# EAGLE design pumpkin_shield (EAGLE 5.11)
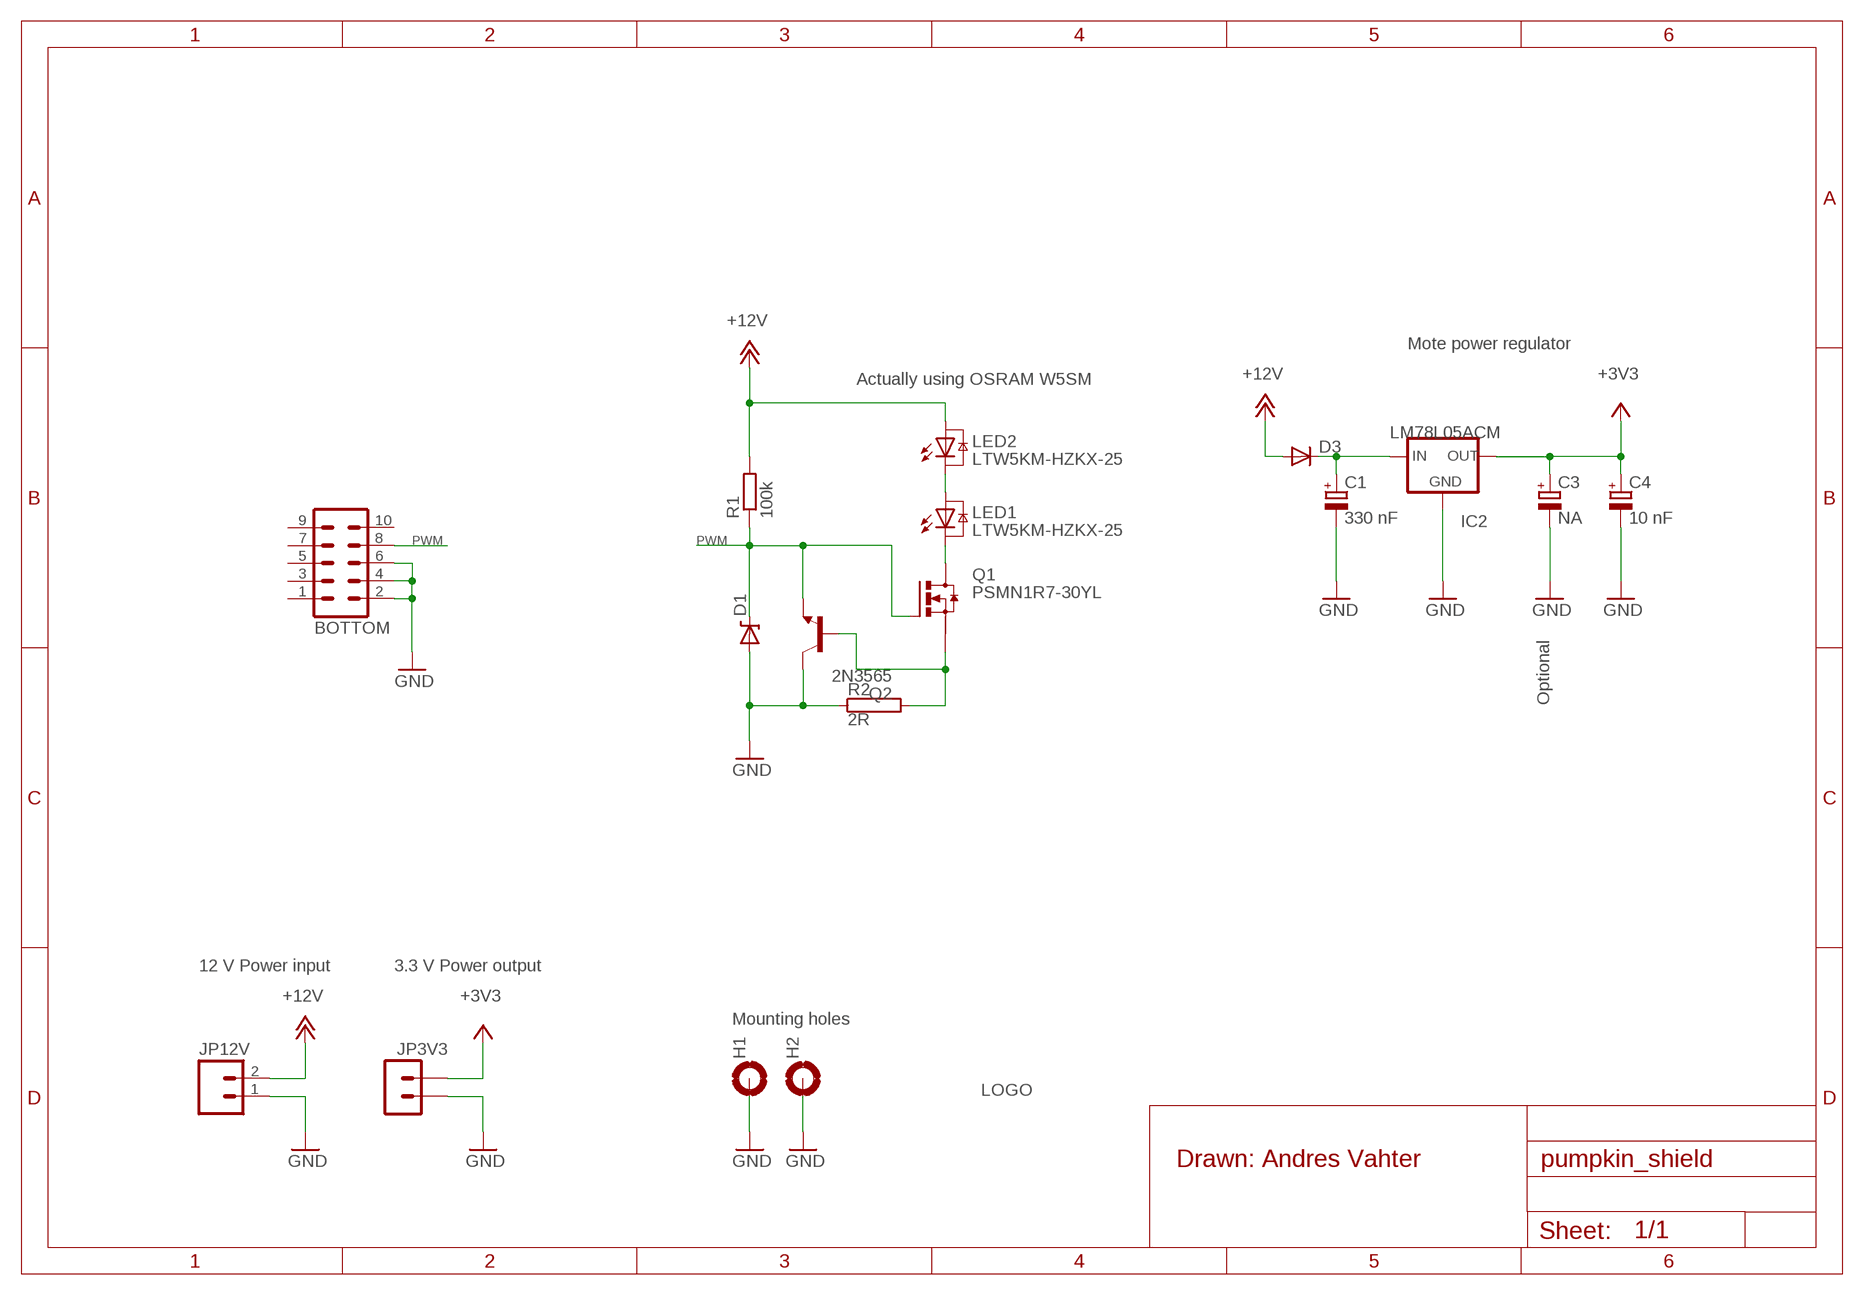
[diagram p0: schematic, sheet 1]

## Parts
BOTTOM  FTSH-105-04-L-DV  [FTSH-105-04-L-DV]
C1  330 nF  CPOL-EUCT6032  [CT6032]
C3  NA  CPOL-EUCT6032  [CT6032]
C4  10 nF  CPOL-EUCT6032  [CT6032]
D1  DIODE-ZENER-BZT52  [SOD-323]
D3  DIODE-DO-214AC  [DO-214AC]
H1  MOUNT-PAD-ROUND3.2  [3,2-PAD]
H2  MOUNT-PAD-ROUND3.2  [3,2-PAD]
IC2  LM78L05ACM  LM78LXX  [SO8]
JP3V3  MICROSPOX  [MICROSPOX]
JP12V  M02PTH  [1X02]
LED1  LTW5KM-HZKX-25  [W5KM]
LED2  LTW5KM-HZKX-25  [W5KM]
Q1  PSMN1R7-30YL  PH7030L  [SOT669]
Q2  2N3565  [TO92]
R1  100k  R-EU_M1206  [M1206]
R2  2R  RAC01  [AC01]
U$1  LOGOSILK  [LOGO_TOP_COPPER]

## Nets
+3V3: C3.+ C4.+ IC2.1(OUT) JP3V3.P$1
+12V: D3.A JP12V.2 LED2.A R1.2
GND: BOTTOM.2 BOTTOM.4 BOTTOM.6 C1.- C3.- C4.- D1.2(A) H1.B3,2(MOUNT) H2.B3,2(MOUNT) IC2.2(GND) JP3V3.P$2 JP12V.1 Q2.1(C) R2.1
N$2: Q1.1(S) Q2.2(B) R2.2
N$7: C1.+ D3.C IC2.8(IN)
N$9: LED1.A LED2.C
N$10: LED1.C Q1.MB(D)
PWM: BOTTOM.8 D1.1(C) Q1.4(G) Q2.3(E) R1.1
Unconnected: BOTTOM.1 BOTTOM.3 BOTTOM.5 BOTTOM.7 BOTTOM.9 BOTTOM.10 LED1.HT@1(TH) LED1.HT@2(TH) LED1.TH LED2.HT@1(TH) LED2.HT@2(TH) LED2.TH Q1.2(S) Q1.3(S)

## Notes on the sheet
- Mote power regulator
- Actually using OSRAM W5SM
- Optional
- 12 V Power input | 3.3 V Power output
- Mounting holes
- Drawn: Andres Vahter

## Power pins joined to a net without a drawn wire
GND: IC2.3(GND) IC2.6(GND) IC2.7(GND)

## Library data of the parts
BOTTOM = Samtec:FTSH-105-04-L-DV: SAMTEC - FTSH-105-04-L-DV - HEADER, 1.27MM, 2X5WAY, SMT
C1 C3 C4 = rcl:CPOL-EU: POLARIZED CAPACITOR, European symbol
D1 = SparkFun:DIODE-ZENER: Zener Diode Production Part - 8199 3.4V Zener Voltage
D3 = Smartdust:DIODE-DO-214AC
H1 H2 = holes:MOUNT-PAD-ROUND: MOUNTING PAD, round
IC2 = Smartdust:LM78LXX
JP3V3 = Smartdust:MICROSPOX: Molex 22035025, 2 ways
JP12V = SparkFun:M02: Header 2 Standard 2-pin 0.1" header. Use with straight break away headers (SKU : PRT-00116), right angle break away headers (PRT-00553), swiss pins (PRT-00743), machine pins (PRT-00117), and female headers (PRT-00115). Molex polarized connector foot print use with SKU : PRT-08233 with associated crimp pins and housings.
LED1 LED2 = led:?W5KM: Golden DRAGON® ARGUS® LED Place TH-Gate and connect pins in schematic. Set DRC-Clearance - Same Signals to 0mm in board. Source: catalog.osram-os.com .. LD_LB_LT_W5KM_Pb_free.pdf; COLOR: true green
Q1 = transistor-power:PH7030L: N-channel TrenchMOS (TM) logic level FET Source: http://www.nxp.com/acrobat_download/datasheets/PH7030L_4.pdf
Q2 = transistor-npn:2N3565: NPN Transistor
R1 = rcl:R-EU_: RESISTOR, European symbol
R2 = resistor-power:R: Power Resitor; OC_FARNELL: unknown; OC_NEWARK: unknown
U$1 = Defendec_logo:LOGO

## Board
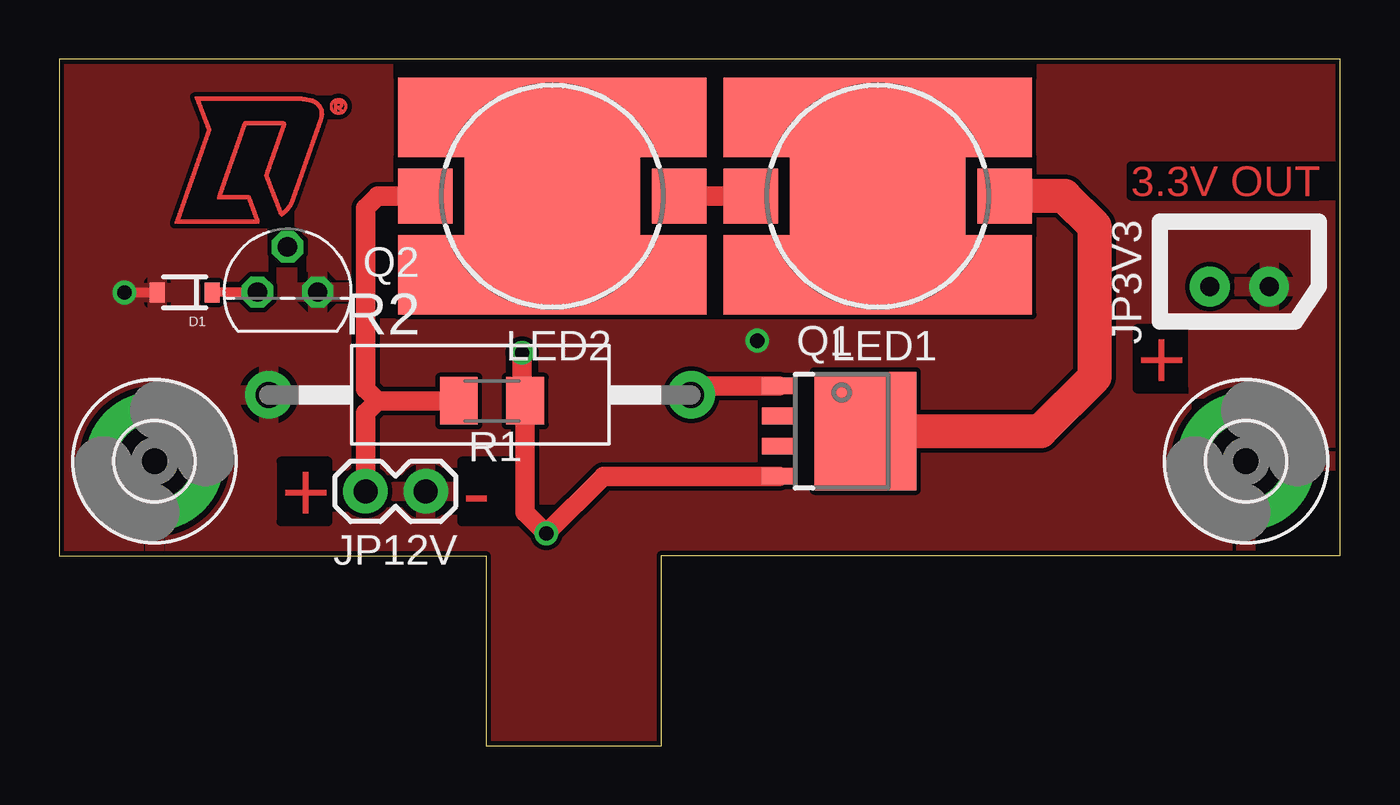
[diagram p1: board, top side]
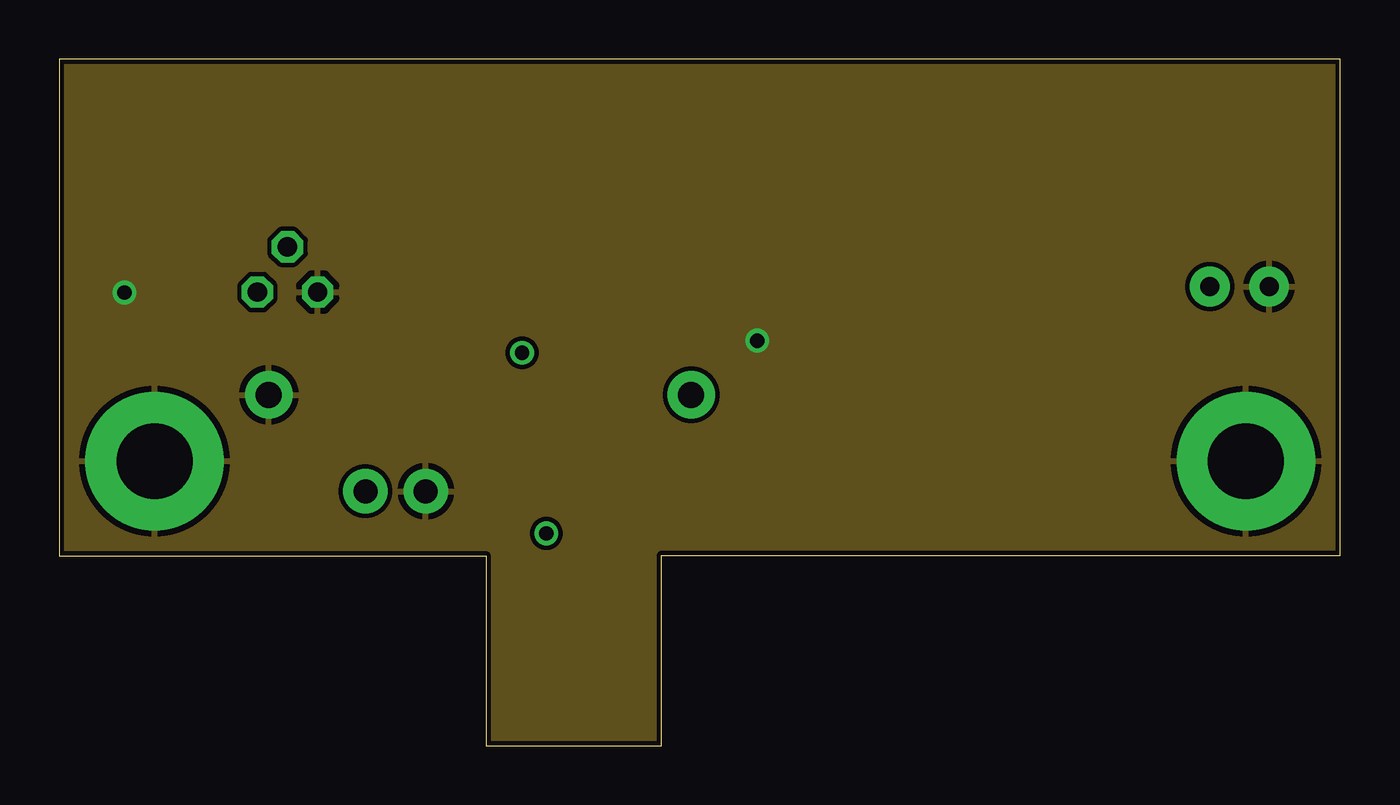
[diagram p2: board, inner layer Route2]
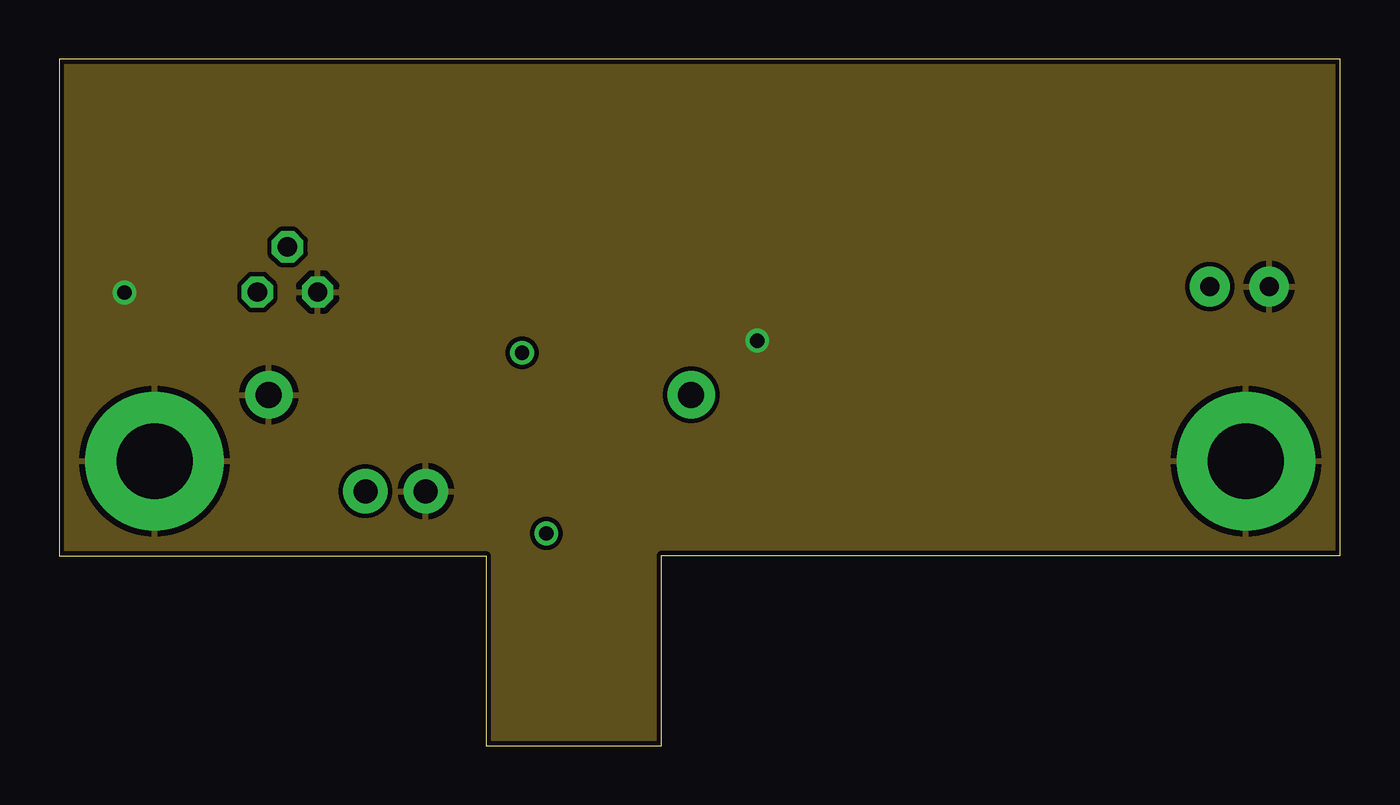
[diagram p3: board, inner layer Route15]
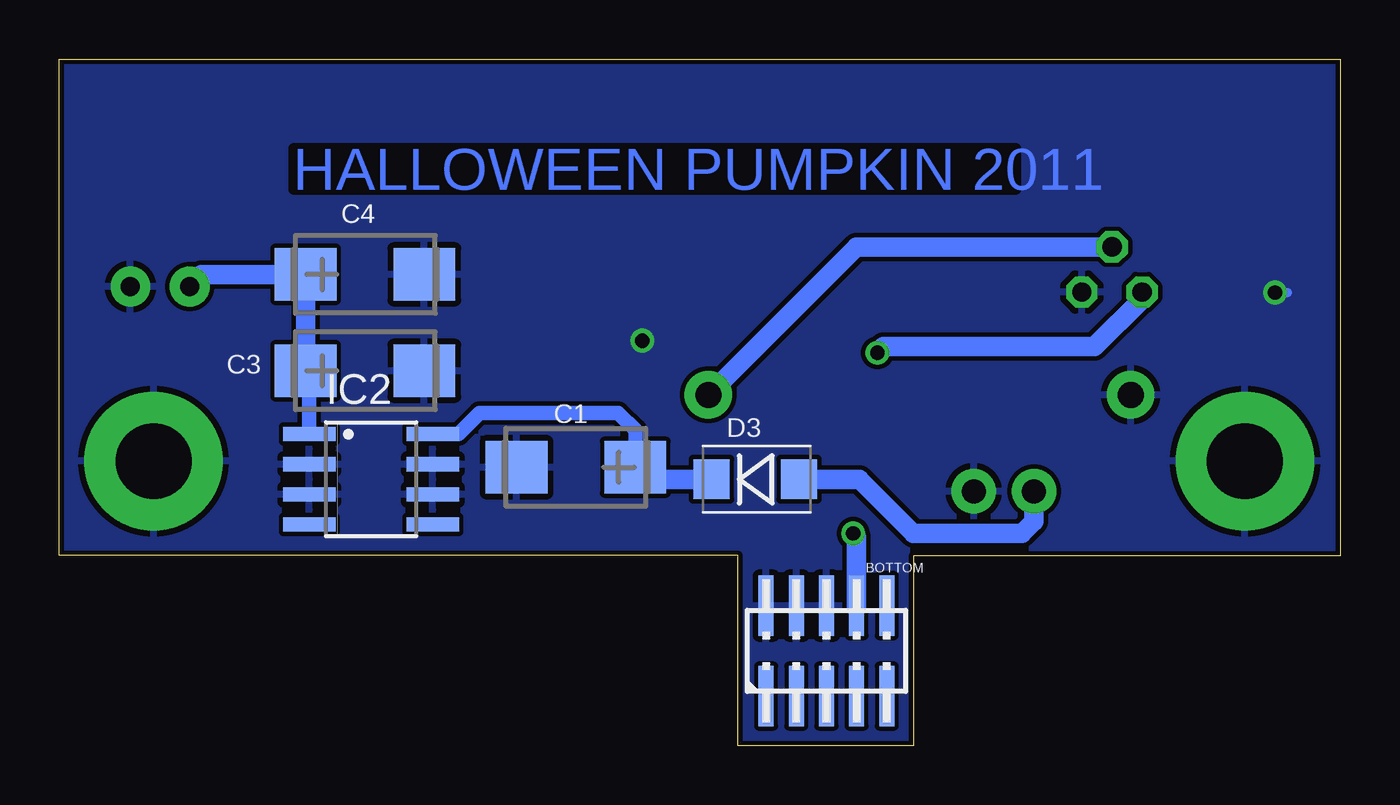
[diagram p4: board, bottom side, seen from below]

Size 53.98 x 28.93 mm. Coordinates in mm from the lower left corner, seen from the top.
Outline: 0,8 17.98,8 17.98,0 25.37,0 25.37,8.03 53.98,8.03 53.98,28.93 0,28.93 0,8
Copper layers (1*2+15*16): Top 0.035mm / dielectric 0.3mm / Route2 0.035mm / dielectric 0.3mm / Route15 0.035mm / dielectric 0.3mm / Bottom 0.035mm
Design rules "brandner": minimum track width 0.05mm, minimum drill 0.1mm, track to track 0.19mm, track to pad 0.19mm, pad to pad 0.19mm, via to via 0.19mm, smd to smd 0.19mm, copper to edge 0.2mm, drill to drill 0.15mm, minimum pad ring 10mil, minimum via ring 8mil, stop-mask expansion 0.05mm, vias tented up to drill 0.8mm, thermal gap 10mil

### Footprints (pad centres in the part's own frame; a part is rotated, then mirrored left to right if it is on the bottom)
FTSH-105-04-L-DV = smd 0.635 x 2.54: 1 -2.667,-1.905; 2 -2.667,1.905; 3 -1.397,-1.905; 4 -1.397,1.905; 5 -0.127,-1.905; 6 -0.127,1.905; 7 1.143,-1.905; 8 1.143,1.905; 9 2.413,-1.905; 10 2.413,1.905
CT6032 = smd 2.6 x 2.2: + -2.5,0; - 2.5,0
SOD-323 = smd 0.63 x 0.83: 1 -1.15,0; 2 1.15,0
DO-214AC = smd 1.524 x 1.676: A 1.778,0; C -1.905,0
3,2-PAD = drill 3.2 pad 5.842 round: B3,2 0,0
SO8 = smd 0.6 x 2.2: 1 -1.905,-2.6; 2 -0.635,-2.6; 3 0.635,-2.6; 4 1.905,-2.6; 5 1.905,2.6; 6 0.635,2.6; 7 -0.635,2.6; 8 -1.905,2.6
MICROSPOX = drill 0.8 pad 1.676 round: P$1 0,1.25; P$2 0,-1.25
1X02 = drill 1.016 pad 1.88 round: 1 0,0; 2 2.54,0
W5KM = smd 2.3 x 2.3: A 0,5.35; C 0,-5.35 | smd 3.35 x 13: HT@1 -3.325,0; HT@2 3.325,0 | smd 3.35 x 7.4: TH 0,0
SOT669 = smd 0.7 x 1.4: 1 -1.905,-2.65; 2 -0.635,-2.65; 3 0.635,-2.65; 4 1.905,-2.65 | smd 5 x 4.3: MB 0,1
TO92 = drill 0.813 octagon: 1 1.27,0; 2 0,1.905; 3 -1.27,0
M1206 = smd 1.6 x 2: 1 -1.4,0; 2 1.4,0
AC01 = drill 1.1 pad 2 round: 1 -8.9,0; 2 8.9,0

### Placement (x,y rotation side)
BOTTOM  21.52,3.99 0 bottom
C1  32.21,11.73 180 bottom
C3  41.1,15.8 0 bottom
C4  41.1,19.86 0 bottom
D1  5.28,19.1 180 top
D3  24.59,11.23 0 bottom
H1  4.01,11.99 0 top
H2  50.01,11.99 0 top
IC2  40.84,11.23 270 bottom
JP3V3  49.73,19.35 90 top
JP12V  15.44,10.72 180 top
LED1  34.49,23.16 90 top
LED2  20.78,23.16 90 top
Q1  32.97,13.26 270 top
Q2  9.62,19.12 0 top
R1  18.24,14.53 180 top
R2  17.73,14.78 0 top
U$1  4.51,21.88 0 top

### Tracks (layer width: path | path; a pad name or v marks a point on that pad's centre or on a via)
+3V3
  Bottom 0.61: IC2.1 43.44,15.64 C3.+
  Bottom 0.813: JP3V3.P$1 47.98,19.86 C4.+ C3.+
+12V
  Top 0.813: 13.41,14.53 R1.2 | 13.41,14.53 12.9,14.02 JP12V.2 | LED2.A 13.41,23.16 12.9,22.66 12.9,15.04 13.41,14.53
  Bottom 0.813: D3.A 20.27,11.23 17.98,8.94 13.41,8.94 12.9,9.45 JP12V.2
GND  (via drill 0.6)
  Top 0.406: D1.2 v2.74,19.1
  Bottom 0.406: v2.74,19.1 2.24,19.1
  other vias: 29.41,17.07
  pour Bottom: -2.59,30.78 56.08,30.78 56.08,-0.71 -2.59,-0.71
  pour Route2: -1.07,29.77 54.81,29.77 54.81,-0.71 -1.07,-0.71
  pour Route15: -1.07,29.77 54.81,29.77 54.81,-0.71 -1.07,-0.71
  pour Top: -1.07,29.77 54.81,29.77 54.81,-0.71 -1.07,-0.71
N$2
  Top 0.813: Q1.1 27.01,15.16 R2.2
  Bottom 0.813: Q2.2 20.39,21.02 R2.2
N$7
  Bottom 0.61: C1.+ 29.71,13.3 30.43,14.02 36.27,14.02 37.16,13.13 IC2.8
  Bottom 0.813: D3.C 29.2,11.23 C1.+
N$9
  Top 0.813: LED2.C LED1.A
N$10
  Top 1.422: LED1.C 42.37,23.16 43.64,21.89 43.64,15.54 41.35,13.26 Q1.MB
PWM  (via drill 0.6)
  Top 0.406: Q2.3 6.45,19.12 D1.1
  Top 0.813: Q1.4 22.94,11.35 v20.52,8.94 19.64,9.83 R1.1 19.51,14.66 v19.51,16.56
  Bottom 0.406: v20.52,8.94 20.38,8.8
  Bottom 0.813: 20.38,8.8 BOTTOM.8 | Q2.3 8.35,18.83 10.36,16.81 19.25,16.81 v19.51,16.56

### Text on the board
Top: 3.3V OUT | + | + | -
Bottom: HALLOWEEN PUMPKIN 2011